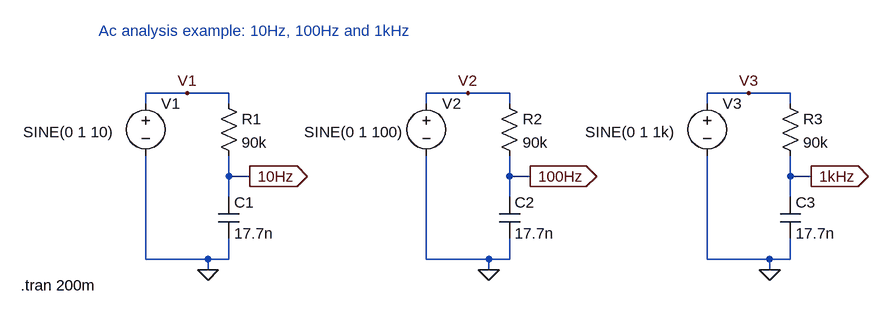
[diagram p0: schematic LTspice 04-1 Fourier and Bode example.asc]
LTspice 04-1 Fourier and Bode example.asc, the LTspice schematic file:
Version 4
SHEET 1 1564 680
WIRE 464 192 400 192
WIRE 528 192 464 192
WIRE 896 192 832 192
WIRE 960 192 896 192
WIRE 1328 192 1264 192
WIRE 1392 192 1328 192
WIRE 400 208 400 192
WIRE 528 208 528 192
WIRE 832 208 832 192
WIRE 960 208 960 192
WIRE 1264 208 1264 192
WIRE 1392 208 1392 192
WIRE 528 320 528 288
WIRE 560 320 528 320
WIRE 960 320 960 288
WIRE 992 320 960 320
WIRE 1392 320 1392 288
WIRE 1424 320 1392 320
WIRE 528 352 528 320
WIRE 960 352 960 320
WIRE 1392 352 1392 320
WIRE 400 448 400 288
WIRE 496 448 400 448
WIRE 528 448 528 416
WIRE 528 448 496 448
WIRE 832 448 832 288
WIRE 928 448 832 448
WIRE 960 448 960 416
WIRE 960 448 928 448
WIRE 1264 448 1264 288
WIRE 1360 448 1264 448
WIRE 1392 448 1392 416
WIRE 1392 448 1360 448
WIRE 496 464 496 448
WIRE 928 464 928 448
WIRE 1360 464 1360 448
FLAG 496 464 0
FLAG 560 320 10Hz
IOPIN 560 320 Out
FLAG 464 192 V1
FLAG 928 464 0
FLAG 992 320 100Hz
IOPIN 992 320 Out
FLAG 896 192 V2
FLAG 1360 464 0
FLAG 1424 320 1kHz
IOPIN 1424 320 Out
FLAG 1328 192 V3
SYMBOL voltage 400 192 R0
WINDOW 39 0 0 Left 2
WINDOW 3 -188 60 Left 2
SYMATTR Value SINE(0 1 10)
SYMATTR InstName V1
SYMBOL res 512 192 R0
SYMATTR InstName R1
SYMATTR Value 90k
SYMBOL cap 512 352 R0
SYMATTR InstName C1
SYMATTR Value 17.7n
SYMBOL voltage 832 192 R0
WINDOW 123 29 91 Left 2
WINDOW 39 0 0 Left 2
WINDOW 3 -188 60 Left 2
SYMATTR Value SINE(0 1 100)
SYMATTR InstName V2
SYMBOL res 944 192 R0
SYMATTR InstName R2
SYMATTR Value 90k
SYMBOL cap 944 352 R0
SYMATTR InstName C2
SYMATTR Value 17.7n
SYMBOL voltage 1264 192 R0
WINDOW 123 29 91 Left 2
WINDOW 39 0 0 Left 2
WINDOW 3 -188 60 Left 2
SYMATTR Value SINE(0 1 1k)
SYMATTR InstName V3
SYMBOL res 1376 192 R0
SYMATTR InstName R3
SYMATTR Value 90k
SYMBOL cap 1376 352 R0
SYMATTR InstName C3
SYMATTR Value 17.7n
TEXT 328 96 Left 2 ;Ac analysis example: 10Hz, 100Hz and 1kHz
TEXT 208 488 Left 2 !.tran 200m

The netlist it stands for:
* LTspice 04-1 Fourier and Bode example.asc
V1 V1 0 SINE(0 1 10)
R1 V1 10Hz 90k
C1 10Hz 0 17.7n
V2 V2 0 SINE(0 1 100)
R2 V2 100Hz 90k
C2 100Hz 0 17.7n
V3 V3 0 SINE(0 1 1k)
R3 V3 1kHz 90k
C3 1kHz 0 17.7n
* Ac analysis example: 10Hz, 100Hz and 1kHz
.tran 200m
.backanno
.end